# EAGLE design bondibar v3d (EAGLE 7.2.0)
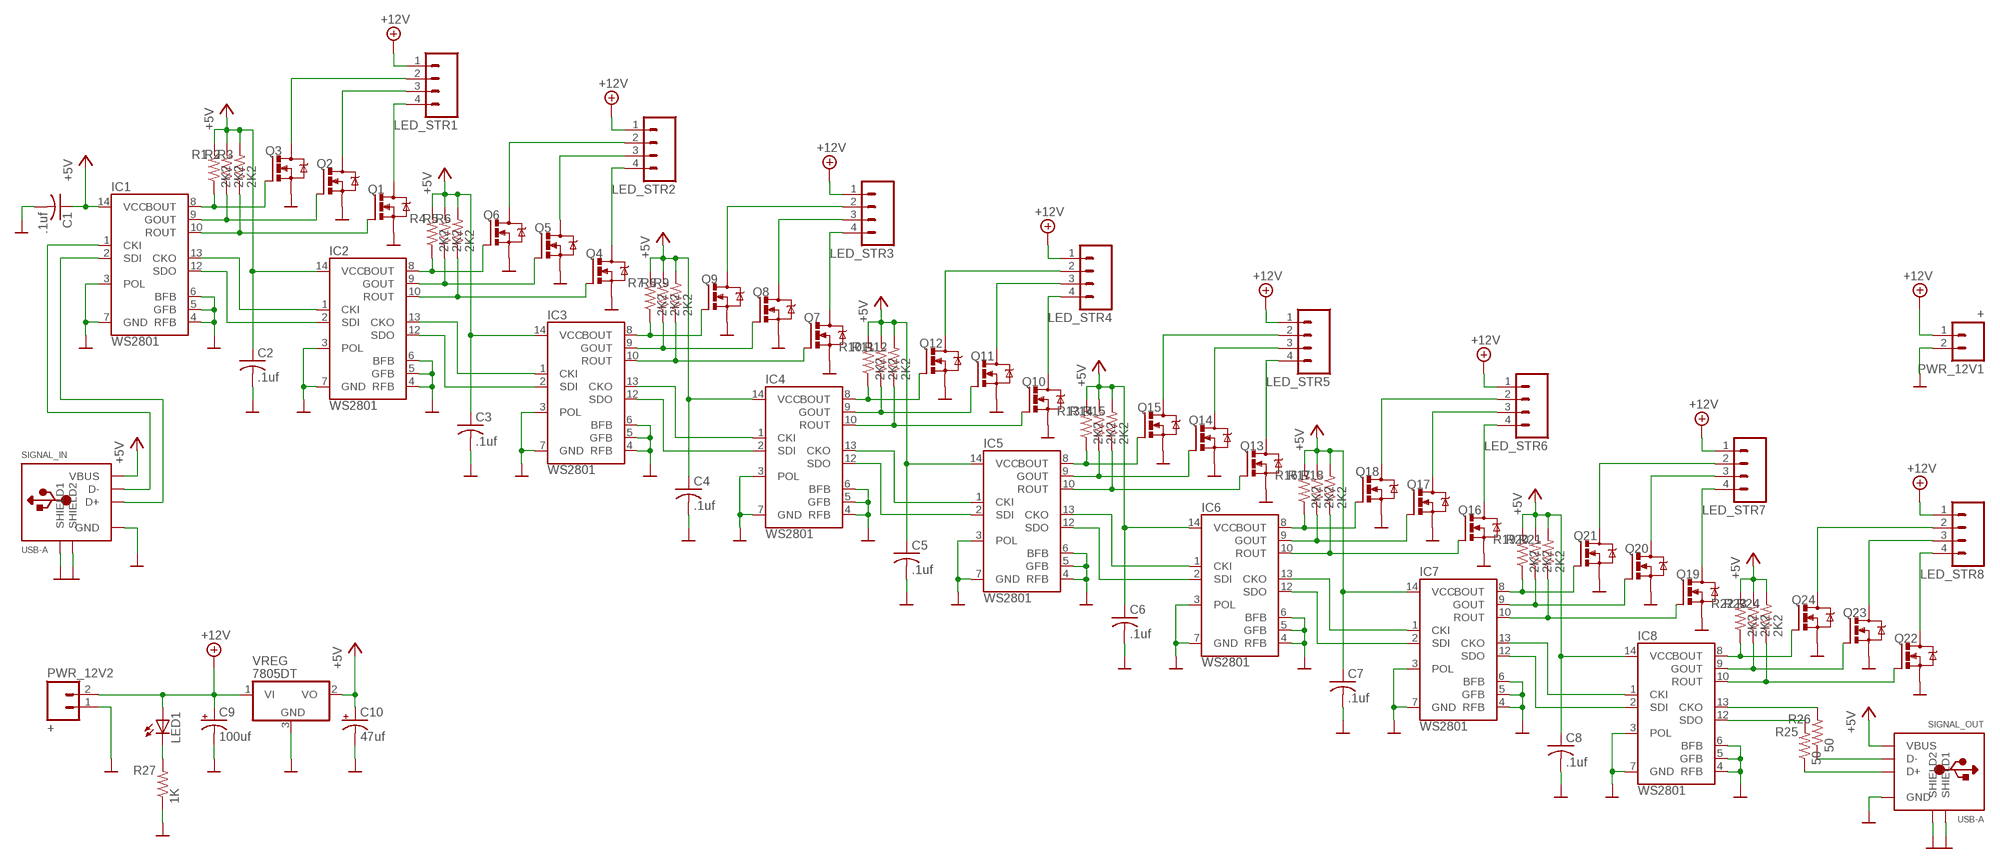
[diagram p0: schematic, sheet 1]

## Parts
C1  .1uf  C-US025-024X044  [C025-024X044]
C2  .1uf  C-US025-024X044  [C025-024X044]
C3  .1uf  C-US025-024X044  [C025-024X044]
C4  .1uf  C-US025-024X044  [C025-024X044]
C5  .1uf  C-US025-024X044  [C025-024X044]
C6  .1uf  C-US025-024X044  [C025-024X044]
C7  .1uf  C-US025-024X044  [C025-024X044]
C8  .1uf  C-US025-024X044  [C025-024X044]
C9  100uf  CPOL-USE2,5-6E  [E2,5-6E]
C10  47uf  CPOL-USE2,5-6E  [E2,5-6E]
IC1  WS2801  [SOP-14]
IC2  WS2801  [SOP-14]
IC3  WS2801  [SOP-14]
IC4  WS2801  [SOP-14]
IC5  WS2801  [SOP-14]
IC6  WS2801  [SOP-14]
IC7  WS2801  [SOP-14]
IC8  WS2801  [SOP-14]
LED1  LED3MM  [LED3MM]
LED_STR1  M04PTH  [1X04]
LED_STR2  M04PTH  [1X04]
LED_STR3  M04PTH  [1X04]
LED_STR4  M04PTH  [1X04]
LED_STR5  M04PTH  [1X04]
LED_STR6  M04PTH  [1X04]
LED_STR7  M04PTH  [1X04]
LED_STR8  M04PTH  [1X04]
PWR_12V1  +  M025MM  [SCREWTERMINAL-5MM-2]
PWR_12V2  +  M025MM  [SCREWTERMINAL-5MM-2]
Q1  IRF520  [TO220BV]
Q2  IRF520  [TO220BV]
Q3  IRF520  [TO220BV]
Q4  IRF520  [TO220BV]
Q5  IRF520  [TO220BV]
Q6  IRF520  [TO220BV]
Q7  IRF520  [TO220BV]
Q8  IRF520  [TO220BV]
Q9  IRF520  [TO220BV]
Q10  IRF520  [TO220BV]
Q11  IRF520  [TO220BV]
Q12  IRF520  [TO220BV]
Q13  IRF520  [TO220BV]
Q14  IRF520  [TO220BV]
Q15  IRF520  [TO220BV]
Q16  IRF520  [TO220BV]
Q17  IRF520  [TO220BV]
Q18  IRF520  [TO220BV]
Q19  IRF520  [TO220BV]
Q20  IRF520  [TO220BV]
Q21  IRF520  [TO220BV]
Q22  IRF520  [TO220BV]
Q23  IRF520  [TO220BV]
Q24  IRF520  [TO220BV]
R1  2K2  R-US_0204/2V  [0204V]
R2  2K2  R-US_0204/2V  [0204V]
R3  2K2  R-US_0204/2V  [0204V]
R4  2K2  R-US_0204/2V  [0204V]
R5  2K2  R-US_0204/2V  [0204V]
R6  2K2  R-US_0204/2V  [0204V]
R7  2K2  R-US_0204/2V  [0204V]
R8  2K2  R-US_0204/2V  [0204V]
R9  2K2  R-US_0204/2V  [0204V]
R10  2K2  R-US_0204/2V  [0204V]
R11  2K2  R-US_0204/2V  [0204V]
R12  2K2  R-US_0204/2V  [0204V]
R13  2K2  R-US_0204/2V  [0204V]
R14  2K2  R-US_0204/2V  [0204V]
R15  2K2  R-US_0204/2V  [0204V]
R16  2K2  R-US_0204/2V  [0204V]
R17  2K2  R-US_0204/2V  [0204V]
R18  2K2  R-US_0204/2V  [0204V]
R19  2K2  R-US_0204/2V  [0204V]
R20  2K2  R-US_0204/2V  [0204V]
R21  2K2  R-US_0204/2V  [0204V]
R22  2K2  R-US_0204/2V  [0204V]
R23  2K2  R-US_0204/2V  [0204V]
R24  2K2  R-US_0204/2V  [0204V]
R25  50  R-US_0204/2V  [0204V]
R26  50  R-US_0204/2V  [0204V]
R27  1K  R-US_0204/2V  [0204V]
SIGNAL_IN  USB-A  USB_TYPEAPTHFML  [USB_HOST-PTH]
SIGNAL_OUT  USB-A  USB_TYPEAPTHFML  [USB_HOST-PTH]
VREG  7805DT  [TO252]

## Nets
+5V [5V]: C1.1 C2.1 C3.1 C4.1 C5.1 C6.1 C7.1 C8.1 C10.+ IC1.14(VCC) IC2.14(VCC) IC3.14(VCC) IC4.14(VCC) IC5.14(VCC) IC6.14(VCC) IC7.14(VCC) IC8.14(VCC) R1.2 R2.2 R3.2 R4.2 R5.2 R6.2 R7.2 R8.2 R9.2 R10.2 R11.2 R12.2 R13.2 R14.2 R15.2 R16.2 R17.2 R18.2 R19.2 R20.2 R21.2 R22.2 R23.2 R24.2 SIGNAL_IN.VBUS SIGNAL_OUT.VBUS VREG.2(VO)
+12V [12V]: C9.+ LED1.A LED_STR1.1 LED_STR2.1 LED_STR3.1 LED_STR4.1 LED_STR5.1 LED_STR6.1 LED_STR7.1 LED_STR8.1 PWR_12V1.1 PWR_12V2.2 VREG.1(VI)
DATA_IN: IC1.1(CKI) SIGNAL_IN.D-
GND [gnd]: C1.2 C2.2 C3.2 C4.2 C5.2 C6.2 C7.2 C8.2 C9.- C10.- IC1.3(POL) IC1.4(RFB) IC1.5(GFB) IC1.6(BFB) IC1.7(GND) IC2.3(POL) IC2.4(RFB) IC2.5(GFB) IC2.6(BFB) IC2.7(GND) IC3.3(POL) IC3.4(RFB) IC3.5(GFB) IC3.6(BFB) IC3.7(GND) IC4.3(POL) IC4.4(RFB) IC4.5(GFB) IC4.6(BFB) IC4.7(GND) IC5.3(POL) IC5.4(RFB) IC5.5(GFB) IC5.6(BFB) IC5.7(GND) IC6.3(POL) IC6.4(RFB) IC6.5(GFB) IC6.6(BFB) IC6.7(GND) IC7.3(POL) IC7.4(RFB) IC7.5(GFB) IC7.6(BFB) IC7.7(GND) IC8.3(POL) IC8.4(RFB) IC8.5(GFB) IC8.6(BFB) IC8.7(GND) PWR_12V1.2 PWR_12V2.1 Q1.S Q2.S Q3.S Q4.S Q5.S Q6.S Q7.S Q8.S Q9.S Q10.S Q11.S Q12.S Q13.S Q14.S Q15.S Q16.S Q17.S Q18.S Q19.S Q20.S Q21.S Q22.S Q23.S Q24.S R27.1 SIGNAL_IN.GND SIGNAL_IN.S1(SHIELD1) SIGNAL_IN.S2(SHIELD2) SIGNAL_OUT.GND SIGNAL_OUT.S1(SHIELD1) SIGNAL_OUT.S2(SHIELD2) VREG.3(GND)
N$1: IC1.8(BOUT) Q3.G R1.1
N$2: IC1.9(GOUT) Q2.G R2.1
N$3: IC1.10(ROUT) Q1.G R3.1
N$4: IC2.8(BOUT) Q6.G R4.1
N$5: IC2.12(SDO) IC3.2(SDI)
N$6: IC2.9(GOUT) Q5.G R5.1
N$7: IC2.10(ROUT) Q4.G R6.1
N$8: IC1.12(SDO) IC2.2(SDI)
N$9: IC2.13(CKO) IC3.1(CKI)
N$10: IC1.13(CKO) IC2.1(CKI)
N$11: IC3.12(SDO) IC4.2(SDI)
N$12: IC3.13(CKO) IC4.1(CKI)
N$13: IC4.13(CKO) IC5.1(CKI)
N$14: IC3.8(BOUT) Q9.G R7.1
N$15: IC3.9(GOUT) Q8.G R8.1
N$16: IC3.10(ROUT) Q7.G R9.1
N$17: IC4.12(SDO) IC5.2(SDI)
N$18: IC5.12(SDO) IC6.2(SDI)
N$19: IC5.13(CKO) IC6.1(CKI)
N$20: IC6.12(SDO) IC7.2(SDI)
N$21: IC6.13(CKO) IC7.1(CKI)
N$22: IC7.12(SDO) IC8.2(SDI)
N$23: IC4.8(BOUT) Q12.G R10.1
N$24: IC4.9(GOUT) Q11.G R11.1
N$25: IC4.10(ROUT) Q10.G R12.1
N$26: IC7.13(CKO) IC8.1(CKI)
N$27 [polenta]: LED_STR1.4 Q1.D
N$28 [polenta]: LED_STR1.3 Q2.D
N$29 [polenta]: LED_STR1.2 Q3.D
N$30 [polenta]: LED_STR4.3 Q11.D
N$31 [polenta]: LED_STR4.4 Q10.D
N$32 [polenta]: LED_STR2.4 Q4.D
N$33 [polenta]: LED_STR2.3 Q5.D
N$34 [polenta]: LED_STR2.2 Q6.D
N$35: IC5.8(BOUT) Q15.G R13.1
N$36: IC5.9(GOUT) Q14.G R14.1
N$37: IC5.10(ROUT) Q13.G R15.1
N$38 [polenta]: LED_STR3.2 Q9.D
N$39 [polenta]: LED_STR3.3 Q8.D
N$40 [polenta]: LED_STR3.4 Q7.D
N$41 [polenta]: LED_STR4.2 Q12.D
N$42 [polenta]: LED_STR5.2 Q15.D
N$43 [polenta]: LED_STR5.3 Q14.D
N$44: IC6.8(BOUT) Q18.G R16.1
N$45: IC6.9(GOUT) Q17.G R17.1
N$46: IC6.10(ROUT) Q16.G R18.1
N$47 [polenta]: LED_STR5.4 Q13.D
N$48 [polenta]: LED_STR6.2 Q18.D
N$49 [polenta]: LED_STR6.3 Q17.D
N$50 [polenta]: LED_STR6.4 Q16.D
N$51 [polenta]: LED_STR7.2 Q21.D
N$52 [polenta]: LED_STR7.3 Q20.D
N$53 [polenta]: LED_STR7.4 Q19.D
N$54 [polenta]: LED_STR8.2 Q24.D
N$55 [polenta]: LED_STR8.3 Q23.D
N$56: IC7.8(BOUT) Q21.G R19.1
N$57: IC7.9(GOUT) Q20.G R20.1
N$58: IC7.10(ROUT) Q19.G R21.1
N$59 [polenta]: LED_STR8.4 Q22.D
N$60: R26.1 SIGNAL_OUT.D-
N$61: IC1.2(SDI) SIGNAL_IN.D+
N$62: IC8.12(SDO) R25.2
N$63: R25.1 SIGNAL_OUT.D+
N$64: IC8.13(CKO) R26.2
N$65: IC8.8(BOUT) Q24.G R22.1
N$66: IC8.9(GOUT) Q23.G R23.1
N$67: IC8.10(ROUT) Q22.G R24.1
N$68: LED1.K(C) R27.2

## Library data of the parts
C1-C8 = adafruit:C-US: CAPACITOR, American symbol
C9 C10 = adafruit:CPOL-US: POLARIZED CAPACITOR, American symbol
IC1-IC8 = SparkFun-DigitalIC:WS2801: WS2801 3 Channel Constant Current LED Driver with programmable PWM outputs. Datasheet: http://www.sparkfun.com/datasheets/Components/LED/WS2801.pdf
LED1 = led:LED: LED OSRAM: - CHIPLED LG R971, LG N971, LY N971, LG Q971, LY Q971, LO R971, LY R971 LH N974, LH R974 LS Q976, LO Q976, LY Q976 LO Q996 - Hyper CHIPLED LW Q18S LB Q993, LB Q99A, LB R99A - SideLED LS A670, LO A670, LY A670, LG A670, LP A670 LB A673, LV A673, LT A673, LW A673 LH A674 LY A675 LS A676, LA A676, LO A676, LY A676, LW A676 LS A679, LY A679, LG A679 - Hyper Micro SIDELED® LS Y876, LA Y876, LO Y876, LY Y876 LT Y87S - SmartLED LW L88C, LW L88S LB L89C, LB L89S, LG L890 LS L89K, LO L89K, LY L89K LS L896, LA L896, LO L896, LY L896 - TOPLED LS T670, LO T670, LY T670, LG T670, LP T670 LSG T670, LSP T670, LSY T670, LOP T670, LYG T670 LG T671, LOG T671, LSG T671 LB T673, LV T673, LT T673, LW T673 LH T674 LS T676, LA T676, LO T676, LY T676, LB T676, LH T676, LSB T676, LW T676 LB T67C, LV T67C, LT T67C, LS T67K, LO T67K, LY T67K, LW E67C LS E67B, LA E67B, LO E67B, LY E67B, LB E67C, LV E67C, LT E67C LW T67C LS T679, LY T679, LG T679 LS T770, LO T770, LY T770, LG T770, LP T770 LB T773, LV T773, LT T773, LW T773 LH T774 LS E675, LA E675, LY E675, LS T675 LS T776, LA T776, LO T776, LY T776, LB T776 LHGB T686 LT T68C, LB T68C - Hyper Mini TOPLED® LB M676 - Mini TOPLED Santana® LG M470 LS M47K, LO M47K, LY M47K Source: http://www.osram.convergy.de LUXEON: - LUMILED® LXK2-PW12-R00, LXK2-PW12-S00, LXK2-PW14-U00, LXK2-PW14-V00 LXK2-PM12-R00, LXK2-PM12-S00, LXK2-PM14-U00 LXK2-PE12-Q00, LXK2-PE12-R00, LXK2-PE12-S00, LXK2-PE14-T00, LXK2-PE14-U00 LXK2-PB12-K00, LXK2-PB12-L00, LXK2-PB12-M00, LXK2-PB14-N00, LXK2-PB14-P00, LXK2-PB14-Q00 LXK2-PR12-L00, LXK2-PR12-M00, LXK2-PR14-Q00, LXK2-PR14-R00 LXK2-PD12-Q00, LXK2-PD12-R00, LXK2-PD12-S00 LXK2-PH12-R00, LXK2-PH12-S00 LXK2-PL12-P00, LXK2-PL12-Q00, LXK2-PL12-R00 Source: www.luxeon.com KINGBRIGHT: KA-3528ASYC Source: www.kingbright.com
LED_STR1-LED_STR8 = SparkFun-Connectors:M04: Header 4 Standard 4-pin 0.1" header. Use with straight break away headers (SKU : PRT-00116), right angle break away headers (PRT-00553), swiss pins (PRT-00743), machine pins (PRT-00117), and female headers (PRT-00115). Molex polarized connector foot print use with SKU : PRT-08231 with associated crimp pins and housings. 1MM SMD Version SKU: PRT-10208
PWR_12V1 PWR_12V2 = SparkFun-Connectors:M02: Header 2 Standard 2-pin 0.1" header. Use with straight break away headers (SKU : PRT-00116), right angle break away headers (PRT-00553), swiss pins (PRT-00743), machine pins (PRT-00117), and female headers (PRT-00115). Molex polarized connector foot print use with SKU : PRT-08233 with associated crimp pins and housings.
Q1-Q24 = transistor-power:IRF520: HEXFET Power MOSFET
R1-R27 = adafruit:R-US_: RESISTOR, American symbol
SIGNAL_IN = microbuilder-palmer:USB_TYPEA: USB - Type A Connectors SMT Male - 4UCON: 10017 PTH Female - ???
SIGNAL_OUT = microbuilder:USB_TYPEA: USB - Type A Connectors SMT Male - 4UCON: 10017 PTH Female - ???
VREG = adafruit:78*: Positive VOLTAGE REGULATOR Added bigger pads to the TO-92 package

## Net classes
0 default: width 0.254 mm, clearance 0.279 mm
1 12V: width 0.711 mm, drill 0.813 mm, clearance 0.457 mm
2 gnd: width 0.457 mm, drill 0.711 mm, clearance 0.356 mm
3 5V: width 0.305 mm, drill 0.508 mm, clearance 0.356 mm
4 polenta: width 0.508 mm, drill 0.61 mm, clearance 0.406 mm

## Board
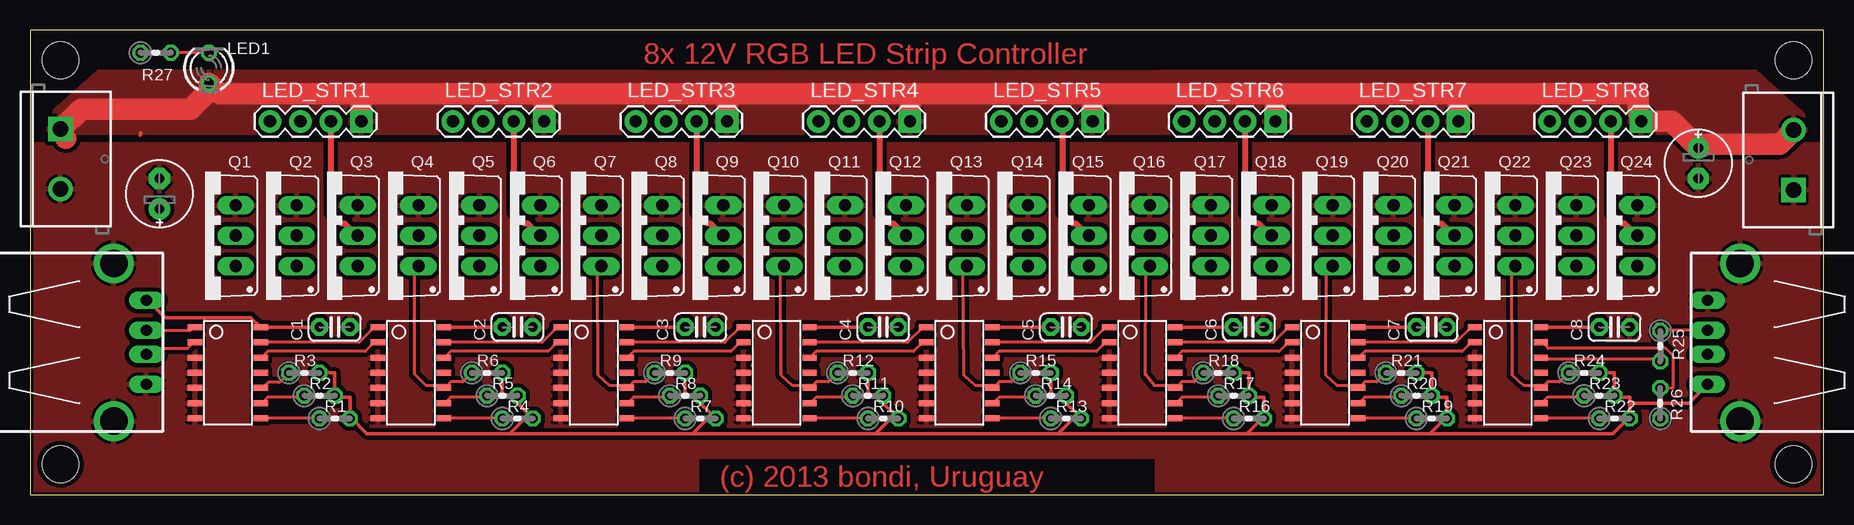
[diagram p1: board, top side]
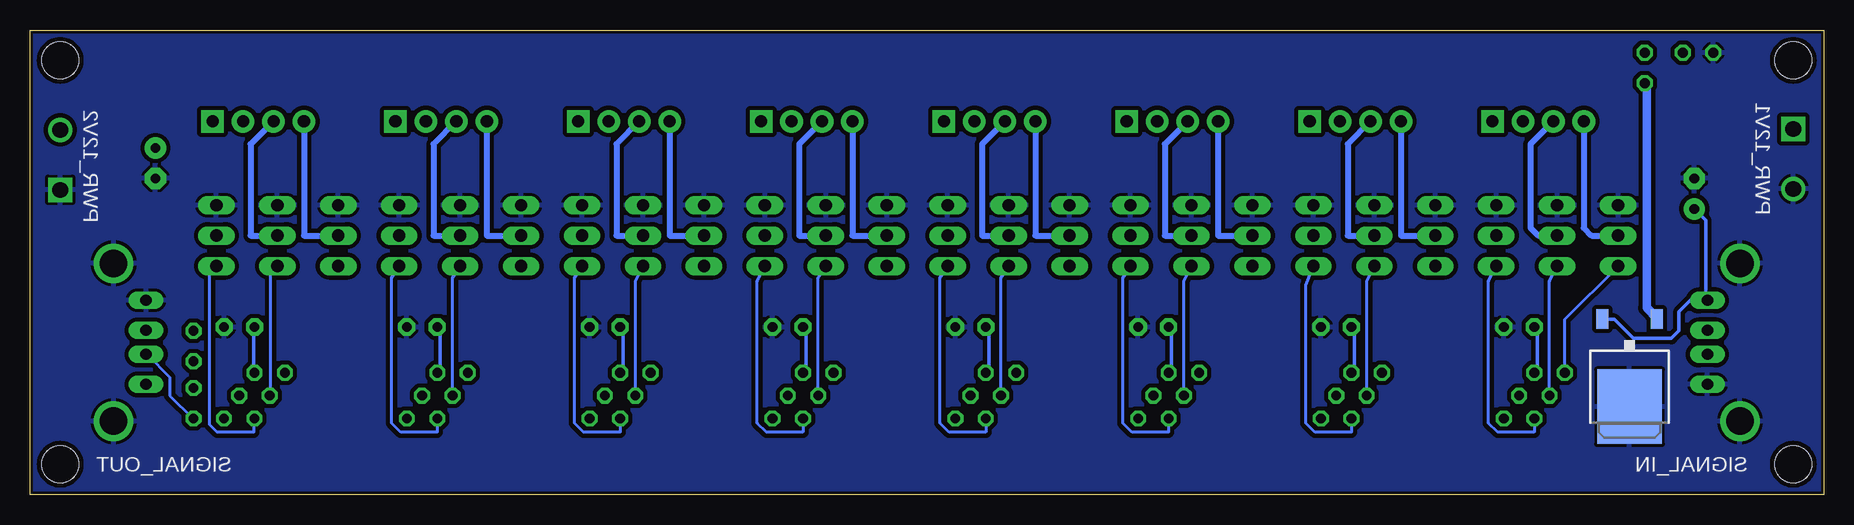
[diagram p2: board, bottom side, seen from below]

Size 149.52 x 38.72 mm. Coordinates in mm from the lower left corner, seen from the top.
Outline: 0,0 149.52,0 149.52,38.72 0,38.72 0,0
Copper layers (1*16): Top 0.035mm / dielectric 1.5mm / Bottom 0.035mm
Design rules "default": minimum track width 6mil, minimum drill 12mil, track to track 6mil, track to pad 6mil, pad to pad 6mil, via to via 6mil, smd to smd 0mil, copper to edge 10mil, drill to drill 10mil, minimum pad ring 10mil, minimum via ring 6mil, stop-mask expansion 2mil, vias tented up to drill 100mil, thermal gap 10mil

### Footprints (pad centres in the part's own frame; a part is rotated, then mirrored left to right if it is on the bottom)
C025-024X044 = drill 0.813 pad 1.422 octagon: 1 -1.27,0; 2 1.27,0
E2,5-6E = drill 0.813 pad 1.778: + -1.27,0 | drill 0.813 pad 1.778 octagon: - 1.27,0
SOP-14 = smd 0.5 x 1.2: 1 -3.81,-2.75; 2 -2.54,-2.75; 3 -1.27,-2.75; 4 0,-2.75; 5 1.27,-2.75; 6 2.54,-2.75; 7 3.81,-2.75; 8 3.81,2.75; 9 2.54,2.75; 10 1.27,2.75; 11 0,2.75; 12 -1.27,2.75; 13 -2.54,2.75; 14 -3.81,2.75
LED3MM = drill 0.813 octagon: A -1.27,0; K 1.27,0
1X04 = drill 1.016 pad 1.88 square: 1 0,0 | drill 1.016 pad 1.88: 2 2.54,0; 3 5.08,0; 4 7.62,0
SCREWTERMINAL-5MM-2 = drill 1.3 pad 2.032 square: 1 0,0 | drill 1.3 pad 2.032: 2 5,0
TO220BV = drill 1.016 long: D 0,-2.54; G -2.54,-2.54; S 2.54,-2.54
0204V = drill 0.813 octagon: 1 -1.27,0; 2 1.27,0
USB_HOST-PTH = drill 0.95 long: D+ 1,6.52; D- -1,6.52; GND 3.5,6.52; VBUS -3.5,6.52 | drill 2.3 pad 2.9: S1 -6.57,3.81; S2 6.57,3.81
STAND-OFF-TIGHT = hole 3.048: 0,0
TO252 = smd 1 x 1.6: 1 -2.28,-4.8; 2 2.28,-4.8 | smd 5.4 x 6.2: 3 0,2.5

### Placement (x,y rotation side)
C1  25.4,13.97 0 top
C2  40.64,13.97 0 top
C3  55.88,13.97 0 top
C4  71.12,13.97 0 top
C5  86.36,13.97 0 top
C6  101.6,13.97 0 top
C7  116.84,13.97 0 top
C8  132.08,13.97 0 top
C9  139.06,27.62 270 top
C10  10.8,25.08 90 top
IC1  16.51,10.16 270 top
IC2  31.75,10.16 270 top
IC3  46.99,10.16 270 top
IC4  62.23,10.16 270 top
IC5  77.47,10.16 270 top
IC6  92.71,10.16 270 top
IC7  107.95,10.16 270 top
IC8  123.19,10.16 270 top
LED1  14.92,35.56 90 top
LED_STR1  27.62,31.11 180 top
LED_STR2  42.86,31.11 180 top
LED_STR3  58.1,31.11 180 top
LED_STR4  73.34,31.11 180 top
LED_STR5  88.58,31.11 180 top
LED_STR6  103.82,31.11 180 top
LED_STR7  119.06,31.11 180 top
LED_STR8  134.3,31.11 180 top
PWR_12V1  2.54,30.48 270 top
PWR_12V2  147,25.4 90 top
Q1  14.61,21.59 90 top
Q2  19.69,21.59 90 top
Q3  24.77,21.59 90 top
Q4  29.84,21.59 90 top
Q5  34.93,21.59 90 top
Q6  40.01,21.59 90 top
Q7  45.09,21.59 90 top
Q8  50.16,21.59 90 top
Q9  55.25,21.59 90 top
Q10  60.33,21.59 90 top
Q11  65.41,21.59 90 top
Q12  70.48,21.59 90 top
Q13  75.56,21.59 90 top
Q14  80.64,21.59 90 top
Q15  85.72,21.59 90 top
Q16  90.81,21.59 90 top
Q17  95.89,21.59 90 top
Q18  100.97,21.59 90 top
Q19  106.05,21.59 90 top
Q20  111.12,21.59 90 top
Q21  116.2,21.59 90 top
Q22  121.28,21.59 90 top
Q23  126.37,21.59 90 top
Q24  131.44,21.59 90 top
R1  25.4,6.35 0 top
R2  24.13,8.26 0 top
R3  22.86,10.16 0 top
R4  40.64,6.35 0 top
R5  39.37,8.26 0 top
R6  38.1,10.16 0 top
R7  55.88,6.35 0 top
R8  54.61,8.26 0 top
R9  53.34,10.16 0 top
R10  71.12,6.35 0 top
R11  69.85,8.26 0 top
R12  68.58,10.16 0 top
R13  86.36,6.35 0 top
R14  85.09,8.26 0 top
R15  83.82,10.16 0 top
R16  101.6,6.35 0 top
R17  100.33,8.26 0 top
R18  99.06,10.16 0 top
R19  116.84,6.35 0 top
R20  115.57,8.26 0 top
R21  114.3,10.16 0 top
R22  132.08,6.35 0 top
R23  130.81,8.26 0 top
R24  129.54,10.16 0 top
R25  135.89,12.38 270 top
R26  135.89,7.62 90 top
R27  10.48,36.83 0 top
SIGNAL_IN  3.17,12.7 270 top
SIGNAL_OUT  146.37,12.7 90 top
U$56  [STAND-OFF-TIGHT]  2.54,36.2 0 top
U$57  [STAND-OFF-TIGHT]  2.54,2.54 0 top
U$58  [STAND-OFF-TIGHT]  147,36.2 0 top
U$59  [STAND-OFF-TIGHT]  147,2.54 0 top
VREG  16.19,9.84 180 bottom

### Tracks (layer width: path | path; a pad name or v marks a point on that pad's centre or on a via)
+5V
  Top 0.305: R24.2 132.08,10.16 R23.2 132.08,8.13 133.35,8.13 133.35,7.62 | 133.35,7.62 R22.2 133.22,6.35 131.95,5.08 116.84,5.08 116.78,5.14 | C7.1 IC7.14 | R21.2 116.84,10.16 R20.2 116.84,8.13 118.11,8.13 R19.2 117.98,6.35 116.78,5.14 | C6.1 IC6.14 | R18.2 101.6,10.16 R17.2 101.6,8.13 102.87,8.13 R16.2 102.74,6.35 101.54,5.14 | C5.1 IC5.14 | R15.2 85.09,8.26 R14.2 85.85,8.13 R13.2 87.25,6.6 85.79,5.14 | C4.1 IC4.14 | R12.2 69.85,8.26 R11.2 70.61,8.13 R10.2 72.01,6.6 70.55,5.14 | C3.1 IC3.14 | R9.2 54.61,8.26 R8.2 55.37,8.13 R7.2 56.77,6.6 55.31,5.14 | C2.1 IC2.14 | R6.2 39.37,8.26 R5.2 40.13,8.13 R4.2 41.53,6.6 40.07,5.14 | R3.2 25.4,10.16 R2.2 25.4,8.13 26.67,8.13 R1.2 26.8,6.35 28.07,5.08 40.01,5.08 40.07,5.14 | 55.31,5.14 55.25,5.08 40.13,5.08 40.07,5.14 | 70.55,5.14 70.48,5.08 55.37,5.08 55.31,5.14 | 85.79,5.14 85.72,5.08 70.61,5.08 70.55,5.14 | 101.54,5.14 101.47,5.08 85.85,5.08 85.79,5.14 | 116.78,5.14 116.71,5.08 101.6,5.08 101.54,5.14 | C1.1 IC1.14 19.21,13.97 18.42,14.76 11.27,14.76 9.84,16.19 SIGNAL_IN.VBUS | C8.1 IC8.14 | 133.35,7.62 138.27,7.62 139.7,9.05 SIGNAL_OUT.VBUS
  Bottom 0.305: C7.1 115.32,13.72 115.32,10.41 R21.2 | C6.1 100.08,13.72 100.08,10.41 R18.2 | C5.1 84.84,13.72 84.84,10.41 R15.2 | C4.1 69.6,13.72 69.6,10.41 R12.2 | C3.1 54.36,13.72 54.36,10.41 R9.2 | C2.1 39.12,13.72 39.12,10.41 R6.2 | C1.1 23.88,13.72 23.88,10.41 R3.2 | R24.2 130.87,10.16 130.87,13.97 C8.1 | C10.+ 9.84,22.86 9.84,16.35 | 9.84,16.35 9.84,16.19 | 9.84,16.35 SIGNAL_IN.VBUS 9.84,16.19 | 9.84,16.19 11.11,16.19 12.07,15.24 12.07,13.65 12.7,13.02 15.87,13.02 17.46,14.61 18.42,14.61 VREG.2
+12V
  Top 0.305: 9.21,29.97 9.25,30.16
  Top 1.778: PWR_12V2.2 147,30.35 145.86,29.21 139.89,29.21 C9.+ 136.84,31.11 LED_STR8.1 134.05,31.88 134.05,33.4 119.06,33.4 | 15.24,33.97 13.4,32.13 4.25,32.13 2.6,30.48 PWR_12V1.1 2.98,29.72 | 15.24,33.97 LED1.A | 27.62,33.4 LED_STR1.1 | 27.62,33.4 15.81,33.4 15.24,33.97 | 42.86,33.4 LED_STR2.1 | 27.62,33.4 42.86,33.4 | 58.1,33.4 LED_STR3.1 | 42.86,33.4 58.1,33.4 | 73.34,33.4 LED_STR4.1 | 58.1,33.4 73.34,33.4 | 88.58,33.4 LED_STR5.1 | 73.34,33.4 88.58,33.4 | 103.82,33.4 LED_STR6.1 | 88.58,33.4 103.82,33.4 | 119.06,33.4 LED_STR7.1 | 103.82,33.4 119.06,33.4
  Bottom 0.711: LED1.A 14.76,34.13 14.76,15.56 13.97,14.76 VREG.1
  pour Top: 5.72,35.24 143.83,35.24 147.32,32.07 147.96,31.43 147.96,30.16 1.59,30.16 1.59,31.43 2.54,32.38
DATA_IN
  Top 0.254: IC1.1 13.65,13.97 13.4,13.72 9.72,13.72 SIGNAL_IN.D-
GND
  pour Bottom: 0,38.73 149.54,38.73 149.54,0 0,0
  pour Top: 0,0 0,29.21 149.54,29.21 149.54,0 93.98,0 93.98,3.17 55.56,3.17 55.56,0
N$1
  Top 0.254: R1.1 IC1.8
  Bottom 0.254: Q3.G 27.94,17.78 27.94,5.97 27.18,5.21 24.13,5.21 R1.1
N$2
  Top 0.254: R2.1 22.73,8.13 19.81,8.13 19.3,7.62 IC1.9
  Bottom 0.254: Q2.G 22.86,17.78 R2.1
N$3
  Top 0.254: R3.1 20.8,9.37 19.84,9.37 19.37,8.89 IC1.10
  Bottom 0.254: Q1.G 21.59,14.61 R3.1
N$4
  Top 0.254: R4.1 IC2.8
  Bottom 0.254: Q6.G 43.18,17.46 43.18,5.97 42.42,5.21 39.37,5.21 R4.1
N$5
  Top 0.254: IC3.2 43.94,12.7 43.18,11.94 35.05,11.94 34.54,11.43 IC2.12
N$6
  Top 0.254: R5.1 37.97,8.13 35.05,8.13 34.54,7.62 IC2.9
  Bottom 0.254: Q5.G 38.1,17.78 R5.1
N$7
  Top 0.254: 34.99,9.33 35.05,9.4 36.07,9.4 R6.1 | 34.99,9.33 34.54,8.89 IC2.10 | Q4.G 32.07,18.73 32.07,10.03 33.02,9.08 34.93,9.08 34.99,9.33
N$8
  Top 0.254: IC2.2 28.7,12.7 27.94,11.94 19.81,11.94 19.3,11.43 IC1.12
N$9
  Top 0.254: IC2.13 42.67,12.7 43.94,13.97 IC3.1
N$10
  Top 0.254: IC1.13 27.43,12.7 28.7,13.97 IC2.1
N$11
  Top 0.254: IC4.2 59.18,12.7 58.42,11.94 50.29,11.94 49.78,11.43 IC3.12
N$12
  Top 0.254: IC3.13 57.91,12.7 59.18,13.97 IC4.1
N$13
  Top 0.254: IC4.13 73.15,12.7 74.42,13.97 IC5.1
N$14
  Top 0.254: R7.1 IC3.8
  Bottom 0.254: Q9.G 58.42,18.1 58.42,5.97 57.66,5.21 54.61,5.21 R7.1
N$15
  Top 0.254: R8.1 53.21,8.13 50.29,8.13 49.78,7.62 IC3.9
  Bottom 0.254: Q8.G 53.34,17.78 R8.1
N$16
  Top 0.254: 50.23,9.33 50.29,9.4 51.31,9.4 R9.1 | 50.23,9.33 49.78,8.89 IC3.10 | Q7.G 47.31,18.61 47.37,9.97 48.32,9.08 50.16,9.08 50.23,9.33
N$17
  Top 0.254: IC5.2 74.42,12.7 73.66,11.94 65.53,11.94 65.02,11.43 IC4.12
N$18
  Top 0.254: IC6.2 89.66,12.7 88.9,11.94 80.77,11.94 80.26,11.43 IC5.12
N$19
  Top 0.254: IC5.13 88.39,12.7 89.66,13.97 IC6.1
N$20
  Top 0.254: IC7.2 104.9,12.7 104.14,11.94 96.01,11.94 95.5,11.43 IC6.12
N$21
  Top 0.254: IC6.13 103.63,12.7 104.9,13.97 IC7.1
N$22
  Top 0.254: IC8.2 120.14,12.7 119.38,11.94 111.25,11.94 110.74,11.43 IC7.12
N$23
  Top 0.254: R10.1 IC4.8
  Bottom 0.254: Q12.G 73.66,18.1 73.66,5.97 72.9,5.21 69.85,5.21 R10.1
N$24
  Top 0.254: R11.1 68.45,8.13 65.53,8.13 65.02,7.62 IC4.9
  Bottom 0.254: Q11.G 68.58,18.1 R11.1
N$25
  Top 0.254: 65.47,9.33 65.53,9.4 66.55,9.4 R12.1 | 65.47,9.33 65.02,8.89 IC4.10 | Q10.G 62.55,18.61 62.61,9.97 63.56,9.08 65.41,9.08 65.47,9.33
N$26
  Top 0.254: IC7.13 118.87,12.7 120.14,13.97 IC8.1
N$27
  Bottom 0.508: Q1.D 19.37,21.59 20,22.22 LED_STR1.4
N$28
  Bottom 0.508: Q2.D 23.81,21.59 24.45,22.22 24.45,29.21 LED_STR1.3
N$29
  Top 0.508: LED_STR1.2 25.08,23.49 25.97,22.61 26.23,22.61 27.24,21.59 Q3.D
N$30
  Bottom 0.508: Q11.D 70.17,21.59 70.17,29.21 LED_STR4.3
N$31
  Bottom 0.508: Q10.D 65.72,21.59 LED_STR4.4
N$32
  Bottom 0.508: Q4.D 35.24,21.59 LED_STR2.4
N$33
  Bottom 0.508: Q5.D 39.69,21.59 39.69,29.21 LED_STR2.3
N$34
  Top 0.508: LED_STR2.2 40.32,23.49 41.21,22.61 41.47,22.61 42.48,21.59 Q6.D
N$35
  Top 0.254: R13.1 IC5.8
  Bottom 0.254: Q15.G 88.9,17.78 88.9,5.97 88.14,5.21 85.09,5.21 R13.1
N$36
  Top 0.254: R14.1 83.69,8.13 80.77,8.13 80.26,7.62 IC5.9
  Bottom 0.254: Q14.G 83.82,18.1 R14.1
N$37
  Top 0.254: 80.71,9.33 80.77,9.4 81.79,9.4 R15.1 | 80.71,9.33 80.26,8.89 IC5.10 | Q13.G 77.79,18.61 77.85,9.97 78.8,9.08 80.64,9.08 80.71,9.33
N$38
  Top 0.508: LED_STR3.2 55.56,23.49 56.45,22.61 56.71,22.61 57.72,21.59 Q9.D
N$39
  Bottom 0.508: Q8.D 54.93,21.59 54.93,29.21 LED_STR3.3
N$40
  Bottom 0.508: Q7.D 50.48,21.59 LED_STR3.4
N$41
  Top 0.508: LED_STR4.2 70.8,23.49 71.69,22.61 71.95,22.61 72.96,21.59 Q12.D
N$42
  Top 0.508: LED_STR5.2 86.04,23.49 86.93,22.61 87.19,22.61 88.2,21.59 Q15.D
N$43
  Bottom 0.508: Q14.D 85.41,21.59 85.41,29.21 LED_STR5.3
N$44
  Top 0.254: R16.1 IC6.8
  Bottom 0.254: Q18.G 104.14,18.1 104.14,5.97 103.38,5.21 100.33,5.21 R16.1
N$45
  Top 0.254: R17.1 98.93,8.13 96.01,8.13 95.5,7.62 IC6.9
  Bottom 0.254: Q17.G 99.06,17.78 R17.1
N$46
  Top 0.254: 95.95,9.33 96.01,9.4 97.03,9.4 R18.1 | 95.95,9.33 95.5,8.89 IC6.10 | Q16.G 93.03,18.61 92.96,10.03 93.73,9.08 95.89,9.08 95.95,9.33
N$47
  Bottom 0.508: Q13.D 80.96,21.59 LED_STR5.4
N$48
  Top 0.508: LED_STR6.2 101.28,23.49 102.17,22.61 102.43,22.61 103.44,21.59 Q18.D
N$49
  Bottom 0.508: Q17.D 100.65,21.59 100.65,29.21 LED_STR6.3
N$50
  Bottom 0.508: Q16.D 96.2,21.59 LED_STR6.4
N$51
  Top 0.508: LED_STR7.2 116.52,23.49 117.41,22.61 117.67,22.61 118.68,21.59 Q21.D
N$52
  Bottom 0.508: Q20.D 115.89,21.59 115.89,29.21 LED_STR7.3
N$53
  Bottom 0.508: Q19.D 111.44,21.59 LED_STR7.4
N$54
  Top 0.508: LED_STR8.2 131.76,23.49 132.65,22.61 132.91,22.61 133.92,21.59 Q24.D
N$55
  Bottom 0.508: Q23.D 131.13,21.59 131.13,29.21 LED_STR8.3
N$56
  Top 0.254: R19.1 IC7.8
  Bottom 0.254: Q21.G 119.38,18.1 119.38,5.97 118.62,5.21 115.57,5.21 R19.1
N$57
  Top 0.254: R20.1 114.17,8.13 111.25,8.13 110.74,7.62 IC7.9
  Bottom 0.254: Q20.G 114.3,18.1 R20.1
N$58
  Top 0.254: 111.19,9.33 111.25,9.4 112.27,9.4 R21.1 | 111.19,9.33 110.74,8.89 IC7.10 | Q19.G 108.08,18.73 108.01,9.97 108.97,9.08 111.12,9.08 111.19,9.33
N$59
  Bottom 0.508: Q22.D 126.68,21.59 LED_STR8.4
N$60
  Bottom 0.254: R26.1 135.95,6.35 137.86,8.26 137.86,9.78 139.76,11.68 SIGNAL_OUT.D-
N$61
  Top 0.254: IC1.2 13.65,12.7 13.14,12.19 10.1,12.19 9.72,11.81 SIGNAL_IN.D+
N$62
  Top 0.254: R25.2 135.7,11.3 126.17,11.3 126.05,11.43 IC8.12
N$63
  Top 0.254: R25.1 135.95,13.72 139.76,13.72 SIGNAL_OUT.D+
N$64
  Top 0.254: R26.2 136.97,8.89 136.97,11.56 136.33,12.19 126.56,12.19 126.05,12.7 IC8.13
N$65
  Top 0.254: R22.1 IC8.8
  Bottom 0.254: Q24.G 134.05,19.05 134.56,18.54 134.56,5.84 133.92,5.21 130.87,5.21 130.87,6.35 R22.1
N$66
  Top 0.254: R23.1 129.41,8.13 126.49,8.13 125.98,7.62 IC8.9
  Bottom 0.254: Q23.G 128.97,19.05 129.48,18.54 129.48,8.26 R23.1
N$67
  Top 0.254: 126.43,9.33 126.49,9.4 127.51,9.4 R24.1 | 126.43,9.33 125.98,8.89 IC8.10 | Q22.G 123.51,18.61 123.57,9.97 124.52,9.08 126.37,9.08 126.43,9.33
N$68
  Top 0.254: LED1.K R27.2

### Text on the board
Top: 8x 12V RGB LED Strip Controller | (c) 2013 bondi, Uruguay